# EAGLE design A4973 (EAGLE 6.5.0)
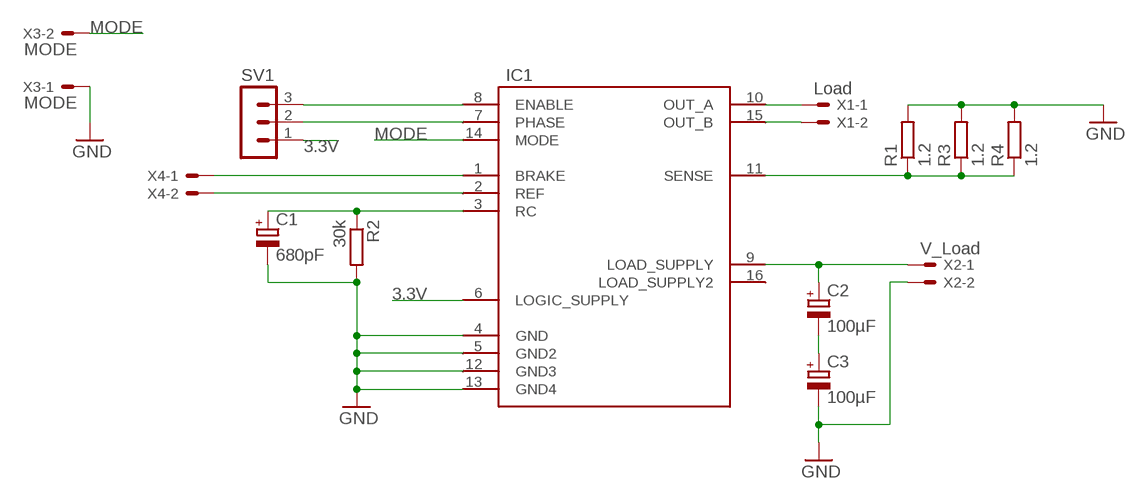
[diagram p0: schematic, sheet 1]

## Parts
C1  680pF  CPOL-EUETR4  [ETR4]
C2  100µF  CPOL-EUE5-13  [E5-13]
C3  100µF  CPOL-EUE5-13  [E5-13]
IC1  A4973DIL  [DIL16]
R1  1.2  R-EU_0207/10  [0207/10]
R2  30k  R-EU_0207/12  [0207/12]
R3  1.2  R-EU_0207/10  [0207/10]
R4  1.2  R-EU_0207/10  [0207/10]
SV1  MA03-1  [MA03-1]
X1  Load  22-23-2021  [22-23-2021]
X2  V_Load  22-23-2021  [22-23-2021]
X3  MODE  332-02  [332-02]
X4  332-02  [332-02]

## Nets
3.3V: IC1.6(LOGIC_SUPPLY) SV1.1
GND: C1.- C3.- IC1.4(GND) IC1.5(GND2) IC1.12(GND3) IC1.13(GND4) R1.2 R2.2 R3.2 R4.2 X2.2 X3.1
MODE: IC1.14(MODE) X3.2
N$1: IC1.8(ENABLE) SV1.3
N$2: IC1.7(PHASE) SV1.2
N$3: C2.- C3.+
N$4: IC1.10(OUT_A) X1.1
N$5: IC1.15(OUT_B) X1.2
N$6: IC1.11(SENSE) R1.1 R3.1 R4.1
N$7: C1.+ IC1.3(RC) R2.1
N$8: C2.+ IC1.9(LOAD_SUPPLY) X2.1
N$9: IC1.1(BRAKE) X4.1
N$10: IC1.2(REF) X4.2
Unconnected: IC1.16(LOAD_SUPPLY2)

## Library data of the parts
C1-C3 = rcl:CPOL-EU: POLARIZED CAPACITOR, European symbol
IC1 = robust:A4973
R1 R3 R4 = resistor:R-EU_: RESISTOR, European symbol
R2 = rcl:R-EU_: RESISTOR, European symbol
SV1 = con-lstb:MA03-1: PIN HEADER; OC_FARNELL: unknown; OC_NEWARK: unknown
X1 X2 = con-molex:22-23-2021: .100" (2.54mm) Center Header - 2 Pin; MF: MOLEX; MPN: 22-23-2021; OC_FARNELL: 1462926; OC_NEWARK: 25C3832
X3 X4 = con-garry:332-02: 2 Pin - 2mm Dual Row Source: www.mpe-connector.de / garry_shortform_2012.pdf

## Board
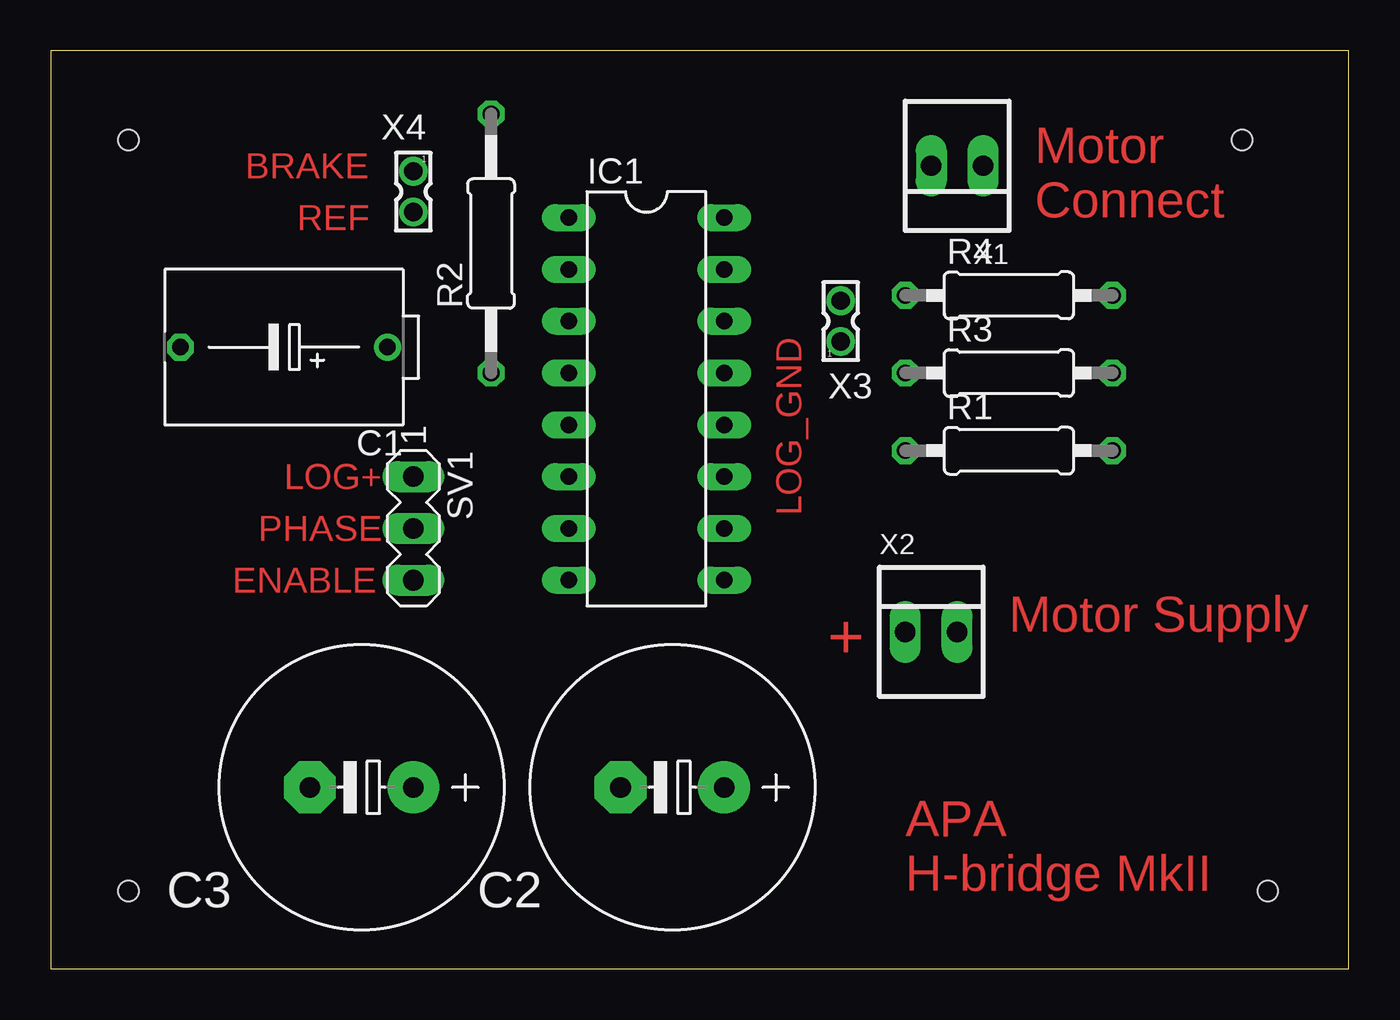
[diagram p1: board, top side]
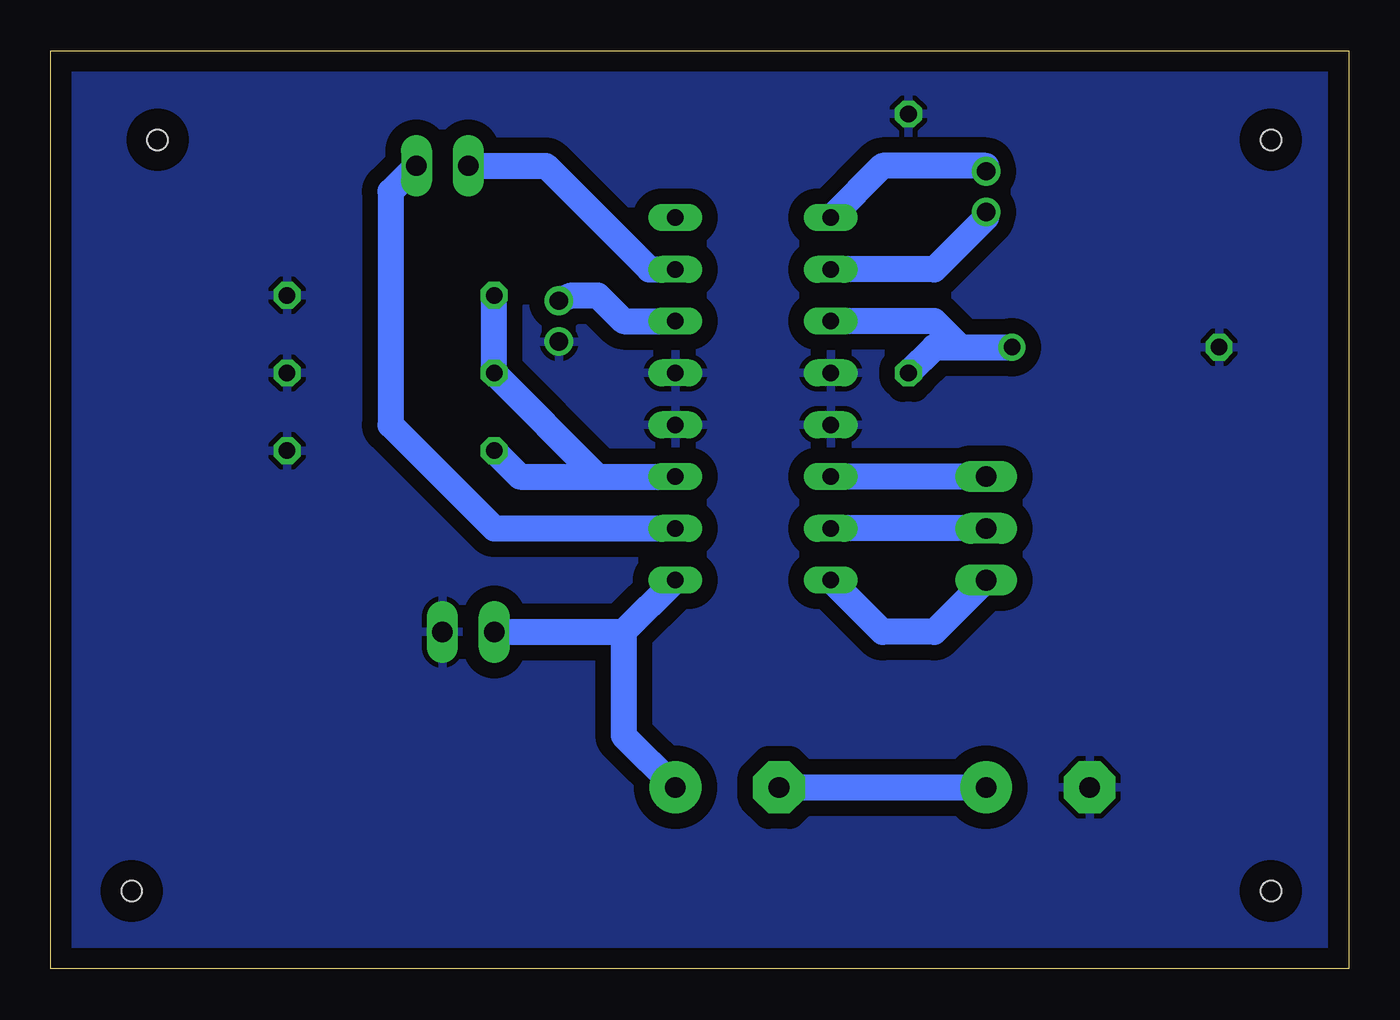
[diagram p2: board, bottom side, seen from below]

Size 63.65 x 45 mm. Coordinates in mm from the lower left corner, seen from the top.
Outline: 0,0 63.65,0 63.65,45 0,45 0,0
Copper layers (1*16): Top 0.035mm / dielectric 1.5mm / Bottom 0.035mm
Design rules "default *": minimum track width 50mil, minimum drill 24mil, track to track 30mil, track to pad 30mil, pad to pad 12mil, via to via 12mil, smd to smd 12mil, copper to edge 40mil, drill to drill 8mil, minimum pad ring 10mil, minimum via ring 8mil, stop-mask expansion 4mil, vias tented up to drill 0mil, thermal gap 10mil
Holes 1 mm at 3.81,3.81 3.81,40.64 59.69,3.81 58.42,40.64

### Footprints (pad centres in the part's own frame; a part is rotated, then mirrored left to right if it is on the bottom)
ETR4 = drill 0.813: + -5.08,0 | drill 0.813 octagon: - 5.08,0
E5-13 = drill 1.016 pad 2.54: + -2.54,0 | drill 1.016 pad 2.54 octagon: - 2.54,0
DIL16 = drill 0.813 long: 1 -8.89,-3.81; 2 -6.35,-3.81; 3 -3.81,-3.81; 4 -1.27,-3.81; 5 1.27,-3.81; 6 3.81,-3.81; 7 6.35,-3.81; 8 8.89,-3.81; 9 8.89,3.81; 10 6.35,3.81; 11 3.81,3.81; 12 1.27,3.81; 13 -1.27,3.81; 14 -3.81,3.81; 15 -6.35,3.81; 16 -8.89,3.81
0207/10 = drill 0.813 octagon: 1 -5.08,0; 2 5.08,0
0207/12 = drill 0.813 octagon: 1 -6.35,0; 2 6.35,0
MA03-1 = drill 1.016 long: 1 -2.54,0; 2 0,0; 3 2.54,0
22-23-2021 = drill 1 long: 1 -1.27,0; 2 1.27,0
332-02 = drill 0.9 pad 1.27: 1 0,-1; 2 0,1

### Placement (x,y rotation side)
C1  11.43,30.48 180 top
C2  30.48,8.89 180 top
C3  15.24,8.89 180 top
IC1  29.21,27.94 270 top
R1  46.99,25.4 0 top
R2  21.59,35.56 90 top
R3  46.99,29.21 0 top
R4  46.99,33.02 0 top
SV1  17.78,21.59 270 top
X1  44.45,39.37 180 top
X2  43.18,16.51 0 top
X3  38.73,31.75 0 top
X4  17.78,38.1 180 top

### Tracks (layer width: path | path; a pad name or v marks a point on that pad's centre or on a via)
3.3V
  Bottom 1.27: SV1.1 IC1.6
GND
  pour Bottom: 0,45.09 0,0 63.5,0 63.5,45.09
MODE
  Bottom 1.27: IC1.14 35.56,31.75 36.83,33.02 38.1,33.02 X3.2
N$1
  Bottom 1.27: IC1.8 22.86,16.51 20.32,16.51 SV1.3
N$2
  Bottom 1.27: SV1.2 IC1.7
N$3
  Bottom 1.27: C2.- C3.+
N$4
  Bottom 1.27: IC1.10 41.91,21.59 46.99,26.67 46.99,38.1 X1.1
N$5
  Bottom 1.27: IC1.15 34.29,34.29 39.37,39.37 X1.2
N$6
  Bottom 1.27: 36.83,24.13 40.64,24.13 R1.1 | 36.83,24.13 IC1.11 | 36.83,24.13 R3.1 R4.1
N$7
  Bottom 1.27: 19.05,30.48 20.32,30.48 R2.1 | 19.05,30.48 C1.+ | IC1.3 20.32,31.75 19.05,30.48
N$8
  Bottom 1.27: 35.56,16.51 IC1.9 | X2.1 35.56,16.51 | C2.+ 35.56,11.43 35.56,16.51
N$9
  Bottom 1.27: IC1.1 22.86,39.37 17.78,39.37 X4.1
N$10
  Bottom 1.27: IC1.2 20.32,34.29 17.78,36.83 X4.2

### Text on the board
Top: BRAKE | Motor / Connect | REF | LOG+ | LOG_GND | PHASE | ENABLE | Motor Supply | + | APA / H-bridge MkII